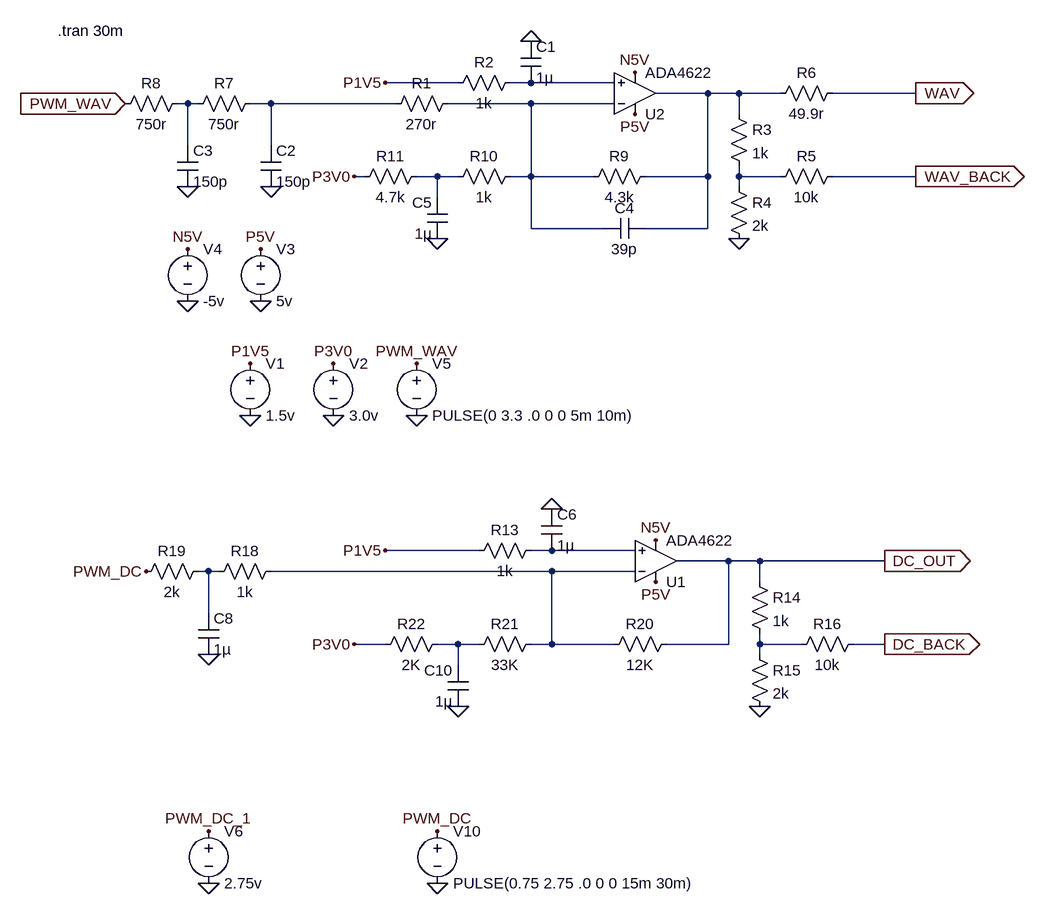
[diagram p0: schematic TL971_原版电路.asc]
TL971_原版电路.asc, the LTspice schematic file:
Version 4
SHEET 1 1680 1284
WIRE -720 32 -832 32
WIRE -608 32 -640 32
WIRE -480 32 -608 32
WIRE -336 48 -416 48
WIRE -288 48 -336 48
WIRE -224 48 -288 48
WIRE -16 48 -144 48
WIRE -1136 64 -1152 64
WIRE -1120 64 -1136 64
WIRE -1008 64 -1040 64
WIRE -816 64 -1008 64
WIRE -608 64 -736 64
WIRE -480 64 -608 64
WIRE -288 80 -288 48
WIRE -1136 128 -1136 64
WIRE -1008 128 -1008 64
WIRE -864 176 -880 176
WIRE -752 176 -784 176
WIRE -720 176 -752 176
WIRE -608 176 -608 64
WIRE -608 176 -640 176
WIRE -512 176 -608 176
WIRE -336 176 -336 48
WIRE -336 176 -432 176
WIRE -288 176 -288 160
WIRE -224 176 -288 176
WIRE -16 176 -144 176
WIRE -288 192 -288 176
WIRE -752 208 -752 176
WIRE -608 256 -608 176
WIRE -496 256 -608 256
WIRE -336 256 -336 176
WIRE -336 256 -432 256
WIRE -688 752 -832 752
WIRE -576 752 -608 752
WIRE -448 752 -576 752
WIRE -304 768 -384 768
WIRE -256 768 -304 768
WIRE -64 768 -256 768
WIRE -1104 784 -1120 784
WIRE -1088 784 -1104 784
WIRE -576 784 -1008 784
WIRE -448 784 -576 784
WIRE -256 800 -256 768
WIRE -1104 848 -1104 784
WIRE -832 896 -880 896
WIRE -720 896 -752 896
WIRE -688 896 -720 896
WIRE -576 896 -576 784
WIRE -576 896 -608 896
WIRE -480 896 -576 896
WIRE -304 896 -304 768
WIRE -304 896 -400 896
WIRE -256 896 -256 880
WIRE -192 896 -256 896
WIRE -64 896 -112 896
WIRE -256 912 -256 896
WIRE -720 928 -720 896
FLAG -1040 544 0
FLAG -608 -32 0
FLAG -288 272 0
FLAG -1136 192 0
FLAG -1008 192 0
FLAG -1232 64 PWM_WAV
IOPIN -1232 64 In
FLAG -16 48 WAV
IOPIN -16 48 Out
FLAG -16 176 WAV_BACK
IOPIN -16 176 Out
FLAG -752 272 0
FLAG -912 544 0
FLAG -1024 368 0
FLAG -1136 368 0
FLAG -784 544 0
FLAG -784 464 PWM_WAV
FLAG -1136 288 N5V
FLAG -1024 288 P5V
FLAG -448 80 P5V
FLAG -448 16 N5V
FLAG -576 688 0
FLAG -256 992 0
FLAG -1104 912 0
FLAG -64 768 DC_OUT
IOPIN -64 768 Out
FLAG -64 896 DC_BACK
IOPIN -64 896 Out
FLAG -720 992 0
FLAG -752 1264 0
FLAG -752 1184 PWM_DC
FLAG -416 800 P5V
FLAG -416 736 N5V
FLAG -1040 464 P1V5
FLAG -912 464 P3V0
FLAG -880 176 P3V0
FLAG -832 32 P1V5
FLAG -832 752 P1V5
FLAG -880 896 P3V0
FLAG -1104 1264 0
FLAG -1104 1184 PWM_DC_1
FLAG -1200 784 PWM_DC
SYMBOL res -720 48 R90
WINDOW 0 0 56 VBottom 2
WINDOW 3 32 56 VTop 2
SYMATTR InstName R1
SYMATTR Value 270r
SYMBOL res -624 16 R90
WINDOW 0 0 56 VBottom 2
WINDOW 3 32 56 VTop 2
SYMATTR InstName R2
SYMATTR Value 1k
SYMBOL voltage -1040 448 R0
WINDOW 123 0 0 Left 0
WINDOW 39 0 0 Left 0
SYMATTR InstName V1
SYMATTR Value 1.5v
SYMBOL cap -624 -32 R0
SYMATTR InstName C1
SYMATTR Value 1µ
SYMBOL res -304 64 R0
SYMATTR InstName R3
SYMATTR Value 1k
SYMBOL res -304 176 R0
SYMATTR InstName R4
SYMATTR Value 2k
SYMBOL res -128 160 R90
WINDOW 0 0 56 VBottom 2
WINDOW 3 32 56 VTop 2
SYMATTR InstName R5
SYMATTR Value 10k
SYMBOL res -128 32 R90
WINDOW 0 0 56 VBottom 2
WINDOW 3 32 56 VTop 2
SYMATTR InstName R6
SYMATTR Value 49.9r
SYMBOL res -1024 48 R90
WINDOW 0 0 56 VBottom 2
WINDOW 3 32 56 VTop 2
SYMATTR InstName R7
SYMATTR Value 750r
SYMBOL res -1136 48 R90
WINDOW 0 0 56 VBottom 2
WINDOW 3 32 56 VTop 2
SYMATTR InstName R8
SYMATTR Value 750r
SYMBOL cap -1024 128 R0
SYMATTR InstName C2
SYMATTR Value 150p
SYMBOL cap -1152 128 R0
SYMATTR InstName C3
SYMATTR Value 150p
SYMBOL res -528 192 R270
WINDOW 0 32 56 VTop 2
WINDOW 3 0 56 VBottom 2
SYMATTR InstName R9
SYMATTR Value 4.3k
SYMBOL cap -432 240 R90
WINDOW 0 0 32 VBottom 2
WINDOW 3 32 32 VTop 2
SYMATTR InstName C4
SYMATTR Value 39p
SYMBOL res -624 160 R90
WINDOW 0 0 56 VBottom 2
WINDOW 3 32 56 VTop 2
SYMATTR InstName R10
SYMATTR Value 1k
SYMBOL cap -736 272 R180
WINDOW 0 24 56 Left 2
WINDOW 3 24 8 Left 2
SYMATTR InstName C5
SYMATTR Value 1µ
SYMBOL res -768 160 R90
WINDOW 0 0 56 VBottom 2
WINDOW 3 32 56 VTop 2
SYMATTR InstName R11
SYMATTR Value 4.7k
SYMBOL voltage -912 448 R0
WINDOW 123 0 0 Left 0
WINDOW 39 0 0 Left 0
SYMATTR InstName V2
SYMATTR Value 3.0v
SYMBOL voltage -1024 272 R0
WINDOW 123 0 0 Left 0
WINDOW 39 0 0 Left 0
SYMATTR InstName V3
SYMATTR Value 5v
SYMBOL voltage -1136 272 R0
WINDOW 123 0 0 Left 0
WINDOW 39 0 0 Left 0
SYMATTR InstName V4
SYMATTR Value -5v
SYMBOL voltage -784 448 R0
WINDOW 123 0 0 Left 0
WINDOW 39 0 0 Left 0
SYMATTR InstName V5
SYMATTR Value PULSE(0 3.3 .0 0 0 5m 10m)
SYMBOL res -592 736 R90
WINDOW 0 0 56 VBottom 2
WINDOW 3 32 56 VTop 2
SYMATTR InstName R13
SYMATTR Value 1k
SYMBOL cap -592 688 R0
SYMATTR InstName C6
SYMATTR Value 1µ
SYMBOL res -272 784 R0
SYMATTR InstName R14
SYMATTR Value 1k
SYMBOL res -272 896 R0
SYMATTR InstName R15
SYMATTR Value 2k
SYMBOL res -96 880 R90
WINDOW 0 0 56 VBottom 2
WINDOW 3 32 56 VTop 2
SYMATTR InstName R16
SYMATTR Value 10k
SYMBOL res -992 768 R90
WINDOW 0 0 56 VBottom 2
WINDOW 3 32 56 VTop 2
SYMATTR InstName R18
SYMATTR Value 1k
SYMBOL res -1104 768 R90
WINDOW 0 0 56 VBottom 2
WINDOW 3 32 56 VTop 2
SYMATTR InstName R19
SYMATTR Value 2k
SYMBOL cap -1120 848 R0
SYMATTR InstName C8
SYMATTR Value 1µ
SYMBOL res -496 912 R270
WINDOW 0 32 56 VTop 2
WINDOW 3 0 56 VBottom 2
SYMATTR InstName R20
SYMATTR Value 12K
SYMBOL res -592 880 R90
WINDOW 0 0 56 VBottom 2
WINDOW 3 32 56 VTop 2
SYMATTR InstName R21
SYMATTR Value 33K
SYMBOL cap -704 992 R180
WINDOW 0 24 56 Left 2
WINDOW 3 24 8 Left 2
SYMATTR InstName C10
SYMATTR Value 1µ
SYMBOL res -736 880 R90
WINDOW 0 0 56 VBottom 2
WINDOW 3 32 56 VTop 2
SYMATTR InstName R22
SYMATTR Value 2K
SYMBOL voltage -752 1168 R0
WINDOW 123 0 0 Left 0
WINDOW 39 0 0 Left 0
SYMATTR InstName V10
SYMATTR Value PULSE(0.75 2.75 .0 0 0 15m 30m)
SYMBOL voltage -1104 1168 R0
WINDOW 123 0 0 Left 0
WINDOW 39 0 0 Left 0
SYMATTR InstName V6
SYMATTR Value 2.75v
SYMBOL OpAmps\\ADA4622 -416 832 M180
SYMATTR InstName U1
SYMBOL OpAmps\\ADA4622 -448 112 M180
SYMATTR InstName U2
TEXT -1336 -48 Left 2 !.tran 30m

The netlist it stands for:
* TL971_原版电路.asc
R1 N005 N004 270r
R2 N001 P1V5 1k
V1 P1V5 0 1.5v
C1 0 N001 1µ
R3 N002 N007 1k
R4 N007 0 2k
R5 WAV_BACK N007 10k
R6 WAV N002 49.9r
R7 N004 N003 750r
R8 N003 PWM_WAV 750r
C2 N004 0 150p
C3 N003 0 150p
R9 N005 N002 4.3k
C4 N002 N005 39p
R10 N005 N006 1k
C5 0 N006 1µ
R11 N006 P3V0 4.7k
V2 P3V0 0 3.0v
V3 P5V 0 5v
V4 N5V 0 -5v
V5 PWM_WAV 0 PULSE(0 3.3 .0 0 0 5m 10m)
R13 N008 P1V5 1k
C6 0 N008 1µ
R14 DC_OUT N012 1k
R15 N012 0 2k
R16 DC_BACK N012 10k
R18 N010 N009 1k
R19 N009 PWM_DC 2k
C8 N009 0 1µ
R20 N010 DC_OUT 12K
R21 N010 N011 33K
C10 0 N011 1µ
R22 N011 P3V0 2K
V10 PWM_DC 0 PULSE(0.75 2.75 .0 0 0 15m 30m)
V6 PWM_DC_1 0 2.75v
XU1 N008 N010 P5V N5V DC_OUT ADA4622  ; pins In+ In- V+ V- OUT
XU2 N001 N005 P5V N5V N002 ADA4622  ; pins In+ In- V+ V- OUT
.tran 30m
.lib ADA4622.lib
.backanno
.end